# EAGLE design untitled (EAGLE 7.2.0)
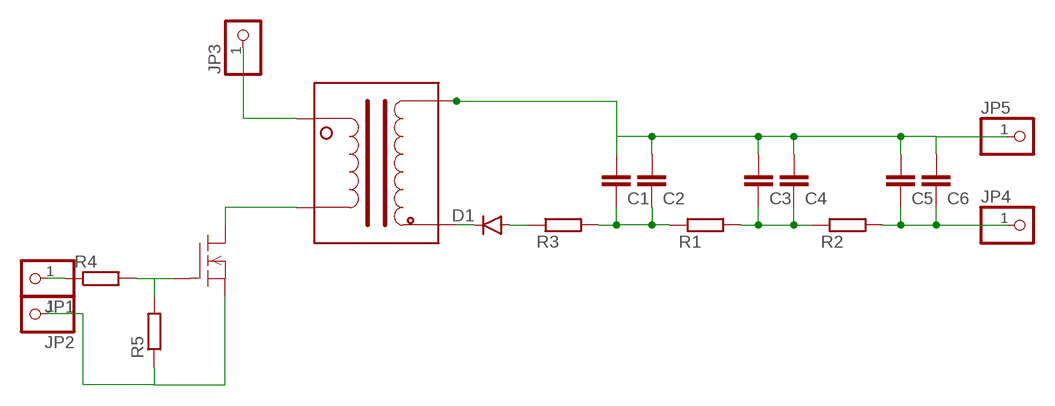
[diagram p0: schematic, sheet 1]

## Parts
C1  CC1206  [C1206]
C2  CC1206  [C1206]
C3  CC1206  [C1206]
C4  CC1206  [C1206]
C5  CC1206  [C1206]
C6  CC1206  [C1206]
D1  DIODESMA  [SMA-DIODE]
JP1  PINHD-1X01_2.54-90°  [1X01/90]
JP2  PINHD-1X01_2.54-90°  [1X01/90]
JP3  PINHD-1X01_2.54-90°  [1X01/90]
JP4  PINHD-1X01_2.54-90°  [1X01/90]
JP5  PINHD-1X01_2.54-90°  [1X01/90]
R1  R0805  [R0805]
R2  R0805  [R0805]
R3  R0805  [R0805]
R4  R0805  [R0805]
R5  R0805  [R0805]
U$1  TR1  [TR1]
U$2  AP9402GYT-HF  [SON-3X3]

## Nets
N$1: C1.1 C2.1 R1.1 R3.2
N$2: C3.1 C4.1 R1.2 R2.1
N$3: C5.1 C6.1 JP4.1 R2.2
N$4: C1.2 C2.2 C3.2 C4.2 C5.2 C6.2 JP5.1 U$1.IN1(OUT1)
N$5: D1.A R3.1
N$6: D1.C U$1.IN2(OUT2)
N$7: R4.2 R5.2 U$2.4(G)
N$8: JP3.1 U$1.OUT2(IN2)
N$9: U$1.OUT1(IN1) U$2.5(D) U$2.6(D) U$2.7(D) U$2.8(D) U$2.9(D)
N$10: JP2.1 R5.1 U$2.1(S) U$2.2(S) U$2.3(S)
N$12: JP1.1 R4.1

## Library data of the parts
C1-C6 = smalsmd:C: Capacitor
D1 = SparkFun-DiscreteSemi:DIODE: Diode These are standard reverse protection diodes and small signal diodes. SMA package can handle up to about 1A. SOD-323 can handle about 200mA. What the SOD-323 package when ordering, there are some mfgs out there that are 5-pin packages.
JP1-JP5 = pinhead-2:PINHD-1X01: PIN HEADER
R1-R5 = smalsmd:R
U$1 = ferr-trans:TR1
U$2 = nexfet:AP9402GYT-HF

## Board
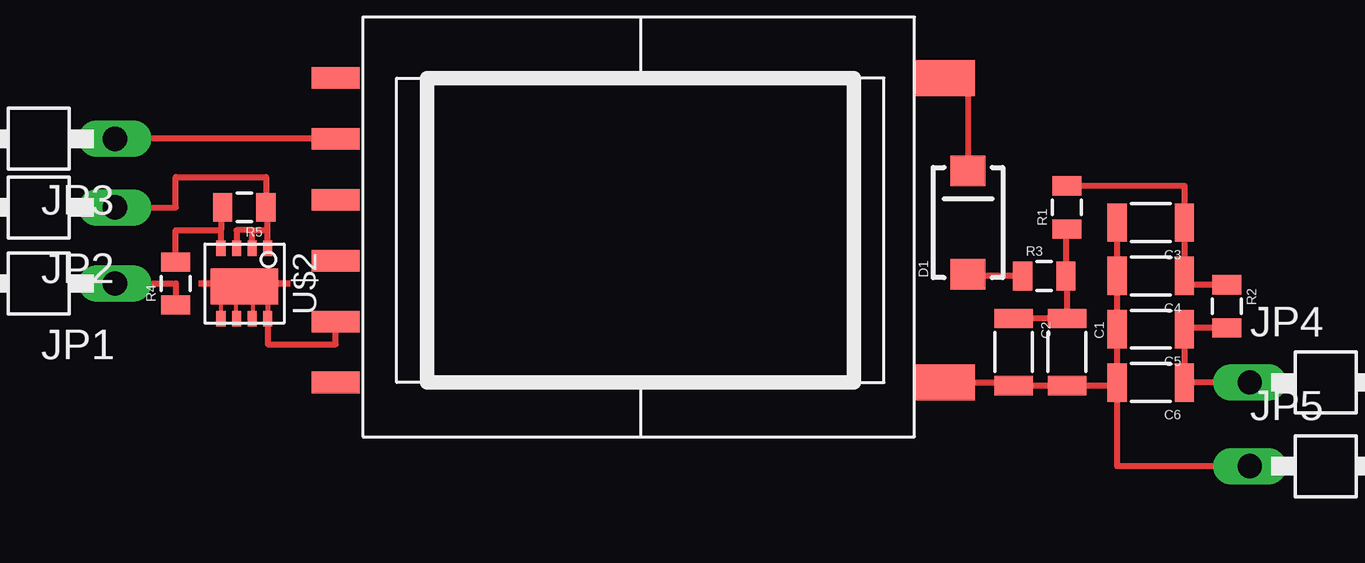
[diagram p1: board, top side]

No outline drawn. Coordinates in mm, seen from the top.
Copper layers (1*16): Top 0.035mm / dielectric 1.5mm / Bottom 0.035mm
Design rules "default": minimum track width 10mil, minimum drill 24mil, track to track 8mil, track to pad 8mil, pad to pad 8mil, via to via 8mil, smd to smd 8mil, copper to edge 40mil, drill to drill 8mil, minimum pad ring 10mil, minimum via ring 8mil, stop-mask expansion 4mil, vias tented up to drill 0mil, thermal gap 10mil

### Footprints (pad centres in the part's own frame; a part is rotated, then mirrored left to right if it is on the bottom)
C1206 = smd 0.8 x 1.6: 1 -1.4,0; 2 1.4,0
SMA-DIODE = smd 1.27 x 1.47: A -2.15,0; C 2.15,0
1X01/90 = drill 1.016 long: 1 -1.27,-3.81
R0805 = smd 0.8 x 1.2: 1 -0.9,0; 2 0.9,0
TR1 = smd 2.5 x 1.5: IN1 -12.7,6.35; IN2 -12.7,-6.35 | smd 2 x 0.9: OUT1 12.7,3.81; OUT2 12.7,-3.81; P$3 12.7,6.35; P$5 12.7,1.27; P$6 12.7,-1.27; P$8 12.7,-6.35
SON-3X3 = smd 0.65 x 0.38: 1 -1.475,0.975; 2 -1.475,0.325; 3 -1.475,-0.325; 4 -1.475,-0.975; 5 1.475,-0.975; 6 1.475,-0.325; 7 1.475,0.325; 8 1.475,0.975 | smd 1.5 x 2.8: 9 0.127,0

### Placement (x,y rotation side)
C1  44.45,25.4 270 top
C2  42.23,25.4 270 top
C3  47.94,30.8 180 top
C4  47.94,28.57 180 top
C5  47.94,26.35 180 top
C6  47.94,24.13 180 top
D1  40.32,30.8 90 top
JP1  0.95,29.53 90 top
JP2  0.95,32.7 90 top
JP3  0.95,35.56 90 top
JP4  55.88,22.86 270 top
JP5  55.88,19.37 270 top
R1  44.45,31.43 90 top
R2  51.12,27.3 270 top
R3  43.5,28.57 0 top
R4  7.3,28.26 90 top
R5  10.16,31.43 180 top
U$1  26.67,30.48 180 top
U$2  10.16,28.26 270 top

### Tracks (layer width: path | path; a pad name or v marks a point on that pad's centre or on a via)
N$1
  Top 0.254: R1.1 44.4,30.53 R3.2 44.45,28.57 C1.1 C2.1
N$2
  Top 0.254: R1.2 49.34,32.33 C3.1 C4.1 49.34,28.2 R2.1
N$3
  Top 0.254: R2.2 49.34,26.41 C5.1 C6.1 JP4.1
N$4
  Top 0.254: U$1.IN1 42.23,24.13 C2.2 C1.2 46.54,24 C6.2 | C6.2 C5.2 C4.2 C3.2 | JP5.1 46.54,20.64 C6.2
N$5
  Top 0.254: R3.1 40.32,28.57 D1.A
N$6
  Top 0.254: U$1.IN2 40.32,36.83 D1.C
N$7
  Top 0.254: R4.2 7.3,30.48 9.19,30.48 | U$2.4 9.19,30.48 | R5.2 9.19,31.43 9.19,30.48
N$8
  Top 0.254: U$1.OUT2 JP3.1
N$9
  Top 0.254: U$2.8 11.13,25.72 13.97,25.72 U$1.OUT1
N$10
  Top 0.254: 11.11,30.48 11.11,31.43 R5.1 11.06,32.7 7.3,32.7 7.3,31.43 JP2.1 | 10.48,30.48 9.84,30.48 U$2.3 | 10.48,29.84 10.48,30.48 | 10.48,30.48 11.11,30.48 | 11.11,30.48 11.11,29.84
N$12
  Top 0.254: JP1.1 7.3,28.26 R4.1